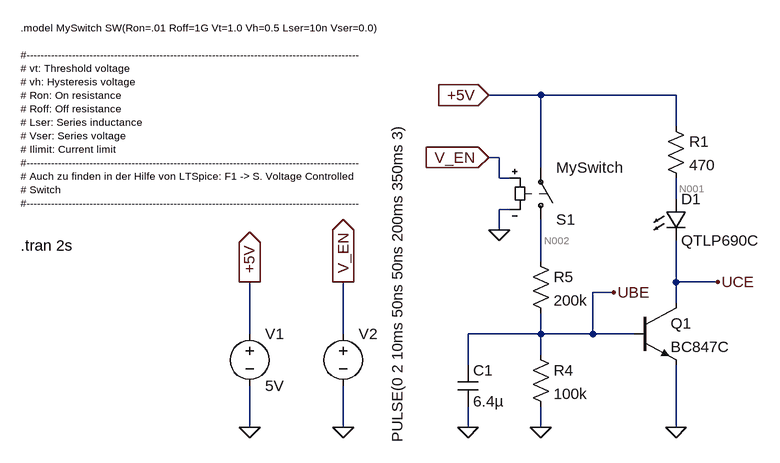
[diagram p0: schematic Hardwareentprellung_mit_RC_Glied.asc]
Hardwareentprellung_mit_RC_Glied.asc, the LTspice schematic file:
Version 4
SHEET 1 1512 680
WIRE 624 -320 544 -320
WIRE 832 -320 624 -320
WIRE 832 -272 832 -320
WIRE 560 -224 544 -224
WIRE 624 -208 624 -320
WIRE 560 -192 560 -224
WIRE 576 -192 560 -192
WIRE 832 -160 832 -192
WIRE 576 -144 560 -144
WIRE 560 -112 560 -144
WIRE 624 -64 624 -128
WIRE 832 -32 832 -96
WIRE 896 -32 832 -32
WIRE 736 -16 704 -16
WIRE 832 0 832 -32
WIRE 176 48 176 -32
WIRE 320 48 320 -32
WIRE 624 48 624 16
WIRE 624 48 512 48
WIRE 704 48 704 -16
WIRE 704 48 624 48
WIRE 768 48 704 48
WIRE 624 80 624 48
WIRE 512 96 512 48
WIRE 176 192 176 128
WIRE 320 192 320 128
WIRE 512 192 512 160
WIRE 624 192 624 160
WIRE 832 192 832 96
FLAG 176 -32 +5V
IOPIN 176 -32 Out
FLAG 320 -32 V_EN
IOPIN 320 -32 Out
FLAG 176 192 0
FLAG 320 192 0
FLAG 544 -224 V_EN
IOPIN 544 -224 In
FLAG 560 -112 0
FLAG 832 192 0
FLAG 544 -320 +5V
IOPIN 544 -320 In
FLAG 624 192 0
FLAG 512 192 0
FLAG 896 -32 UCE
FLAG 736 -16 UBE
SYMBOL LED 816 -160 R0
SYMATTR InstName D1
SYMATTR Value QTLP690C
SYMATTR Description Diode
SYMATTR Type diode
SYMBOL res 816 -288 R0
SYMATTR InstName R1
SYMATTR Value 470
SYMBOL voltage 176 32 R0
WINDOW 123 0 0 Left 2
WINDOW 39 0 0 Left 2
SYMATTR InstName V1
SYMATTR Value 5V
SYMBOL voltage 320 32 R0
WINDOW 3 83 183 VLeft 2
WINDOW 123 0 0 Left 2
WINDOW 39 0 0 Left 2
SYMATTR Value PULSE(0 2 10ms 50ns 50ns 200ms 350ms 3)
SYMATTR InstName V2
SYMBOL sw 624 -112 M180
SYMATTR InstName S1
SYMATTR Value MySwitch
SYMBOL res 608 64 R0
SYMATTR InstName R4
SYMATTR Value 100k
SYMBOL res 608 -80 R0
SYMATTR InstName R5
SYMATTR Value 200k
SYMBOL npn 768 0 R0
SYMATTR InstName Q1
SYMATTR Value BC847C
SYMBOL cap 496 96 R0
SYMATTR InstName C1
SYMATTR Value 6.4µ
TEXT -176 -424 Left 1 !.model MySwitch SW(Ron=.01 Roff=1G Vt=1.0 Vh=0.5 Lser=10n Vser=0.0)\n \n#-----------------------------------------------------------------------------------------------\n# vt: Threshold voltage\n# vh: Hysteresis voltage\n# Ron: On resistance\n# Roff: Off resistance\n# Lser: Series inductance\n# Vser: Series voltage\n# Ilimit: Current limit\n#-----------------------------------------------------------------------------------------------\n# Auch zu finden in der Hilfe von LTSpice: F1 -> S. Voltage Controlled\n# Switch\n#-----------------------------------------------------------------------------------------------
TEXT -176 -88 Left 2 !.tran 2s

The netlist it stands for:
* Hardwareentprellung_mit_RC_Glied.asc
D1 N001 UCE QTLP690C
R1 +5V N001 470
V1 +5V 0 5V
V2 V_EN 0 PULSE(0 2 10ms 50ns 50ns 200ms 350ms 3)
S1 N002 +5V V_EN 0 MySwitch
R4 UBE 0 100k
R5 N002 UBE 200k
Q1 UCE UBE 0 0 BC847C
C1 UBE 0 6.4µ
.model D D
.lib standard.dio
.model NPN NPN
.model PNP PNP
.lib standard.bjt
.model MySwitch SW(Ron=.01 Roff=1G Vt=1.0 Vh=0.5 Lser=10n Vser=0.0)
#-----------------------------------------------------------------------------------------------
# vt: Threshold voltage
# vh: Hysteresis voltage
# Ron: On resistance
# Roff: Off resistance
# Lser: Series inductance
# Vser: Series voltage
# Ilimit: Current limit
#-----------------------------------------------------------------------------------------------
# Auch zu finden in der Hilfe von LTSpice: F1 -> S. Voltage Controlled
# Switch
#-----------------------------------------------------------------------------------------------
.tran 2s
.backanno
.end

* Results of the author's LTspice run, read from the files saved beside the schematic
* Operating Point, zero values left out:
*   V(n001) = 5 V
*   V(uce) = 4.017 V
*   V(+5v) = 5 V
*   V(n002) = 1.502 mV
*   V(ube) = 501.5 µV
*   Ic(Q1) = 11.11 pA
*   Ib(Q1) = -11.08 pA
*   I(D1) = 11.11 pA
*   I(R5) = 5.003 nA
*   I(R4) = 5.015 nA
*   I(R1) = 11.11 pA
*   I(S1) = 5.003 nA
*   I(V1) = -5.015 nA
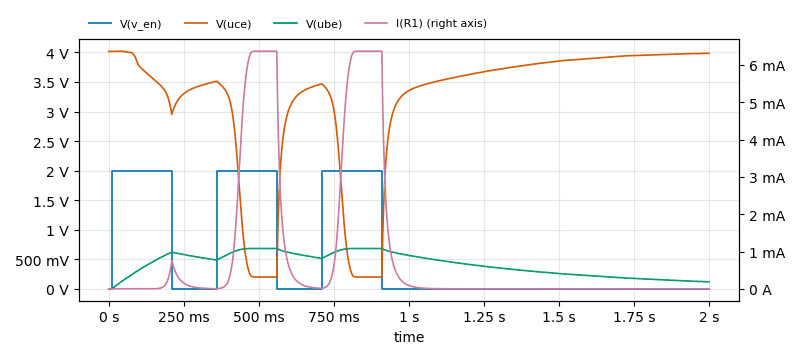
[diagram p1: Transient Analysis of Hardwareentprellung_mit_RC_Glied.asc, plotted from the saved traces]
* Transient Analysis, 1 run:
*   V(v_en): min 0 V, max 2 V, average 600 mV, rms 1.095 V, last 0 V
*   V(uce): min 200.5 mV, max 4.02 V, average 3.155 V, rms 3.365 V, last 3.986 V
*   V(ube): min 501.5 µV, max 683 mV, average 419.3 mV, rms 462.5 mV, last 118.7 mV
*   I(R1): min 0 A, max 6.366 mA, average 948 µA, rms 2.273 mA, last 0 A